# Altium schematic sheet POWER.SchDoc
size A4
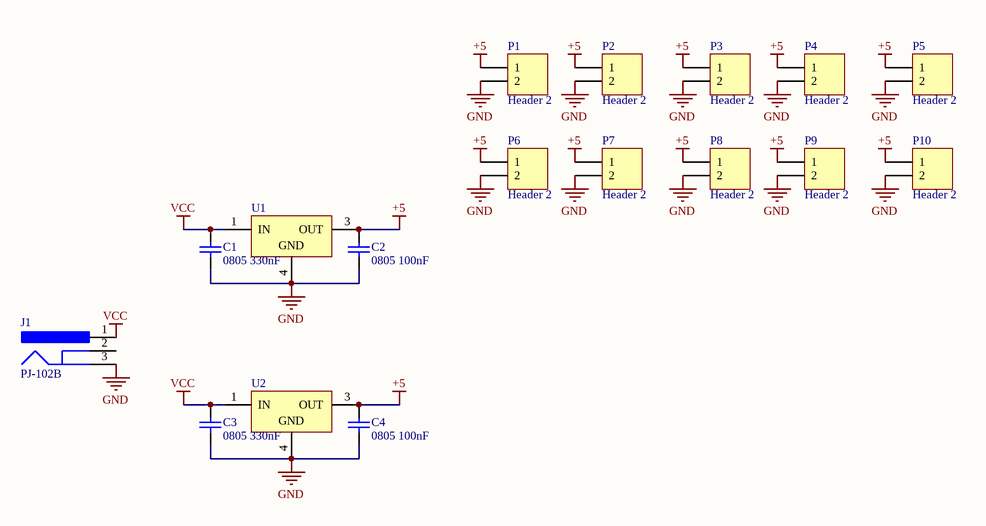
[diagram p0: POWER.SchDoc]

## Parts
C1  0805 330nF  [CAPC0805(2012)100_L]
C2  0805 100nF  [CAPC0805(2012)100_M]
C3  0805 330nF  [CAPC0805(2012)100_L]
C4  0805 100nF  [CAPC0805(2012)100_M]
J1  PJ-102B  [CUI-PJ-102B_V]
P1  Header 2  [HDR1X2]
P2  Header 2  [HDR1X2]
P3  Header 2  [HDR1X2]
P4  Header 2  [HDR1X2]
P5  Header 2  [HDR1X2]
P6  Header 2  [HDR1X2]
P7  Header 2  [HDR1X2]
P8  Header 2  [HDR1X2]
P9  Header 2  [HDR1X2]
P10  Header 2  [HDR1X2]
U1  L7805ABD2T-TR  [TO-263_M]  (value not drawn)
U2  L7805ABD2T-TR  [TO-263_M]  (value not drawn)

## Nets
+5: C2.2 C4.2 P1.1 P2.1 P3.1 P4.1 P5.1 P6.1 P7.1 P8.1 P9.1 P10.1 U1.3(OUT) U2.3(OUT)
GND: C1.2 C2.1 C3.2 C4.1 J1.3 P1.2 P2.2 P3.2 P4.2 P5.2 P6.2 P7.2 P8.2 P9.2 P10.2 U1.4(GND) U2.4(GND)
VCC: C1.1 C3.1 J1.1 U1.1(IN) U2.1(IN)

Not connected (* = marked no-connect by the designer): J1 2

## Library data of the parts
C1 C3 = CMP-1036-04605-1: CAP 330nF 50V ±5% 0805 (2012 Metric) Thickness 1mm SMD; Case-EIA: 0805; Case-Metric: 2012; Tolerance: Â±5%; Value: 330nF; Max Thickness: 1 mm; Technology: SMT; Rated Voltage: 50 V
C2 C4 = CMP-1036-04420-1: CAP 100nF 50V ±10% 0805 (2012 Metric) Thickness 1mm SMD; Case-EIA: 0805; Tolerance: Â±10%; Case-Metric: 2012; Rated Voltage: 50 V; Value: 100nF; Max Thickness: 1 mm; Technology: SMT
J1 = CMP-2000-06900-1: Through Hole Right Angle DC Power Jack, 2.5 A, 2.5 mm Center Pin, 3 Position, -25 to 85 degC, RoHS, Bulk; Manufacturer: CUIInc.; Insulation Resistance: 100MOhms; Inside Contact Diameter: 2.5mm; Outside Contact Diameter: 6.5mm; Voltage Rating: 24V; Current Rating: 2.5A; Brand: CUI; Datasheet URL: http://www.cui.com/product/resource/pj-102b.pdf; Housing Material: PolybutyleneTerephthalate(PBT); Operating Temperature Range: -25Cto+85C; Package Reference: PJ-102B; Factory Pack Quantity: 280; RoHS: True; Contact Material: Copper; Datasheet Version: Rev. 1.03, 04/2016; Product: Jacks; Mounting Angle: Right; Mounting Style: ThroughHole; Flammability Rating: UL94V-0; Product Category: DCPowerConnectors; Contact Gender: Male; Termination Style: ThroughHole; Manufacturer URL: http://www.cui.com/; Mounting Technology: ThroughHole; Package Description: 3-Pin Through Hole Device, Body 14.4 x 9 mm, Height 11 mm; Contact Plating: Nickel; Packaging: Bulk; Connector Type: DCPowerJack
P1-P10 = Header 2: Header, 2-Pin; LatestRevisionDate: 17-Jul-2002; LatestRevisionNote: Re-released for DXP Platform.; Publisher: Altium Limited
U1 U2 = CMP-0244-00199-1: Positive Voltage Regulator, 3-Pin D2PAK, Tape and Reel; ComponentLink1Description: Manufacturer URL; ComponentLink1URL: http://www.st.com; ComponentLink2URL: http://www.st.com/internet/com/TECHNICAL_RESOURCES/TECHNICAL_LITERATURE/DATASHEET/CD00000444.pdf; PackageDescription: 3-Pin Transistor Outline Package 2.54 mm Pitch, 15.4 mm Lead Span (D2PAK); PackageVersion: 2011; PackageReference: TO-263; DatasheetVersion: 16/11/2011; ComponentLink2Description: Datasheet